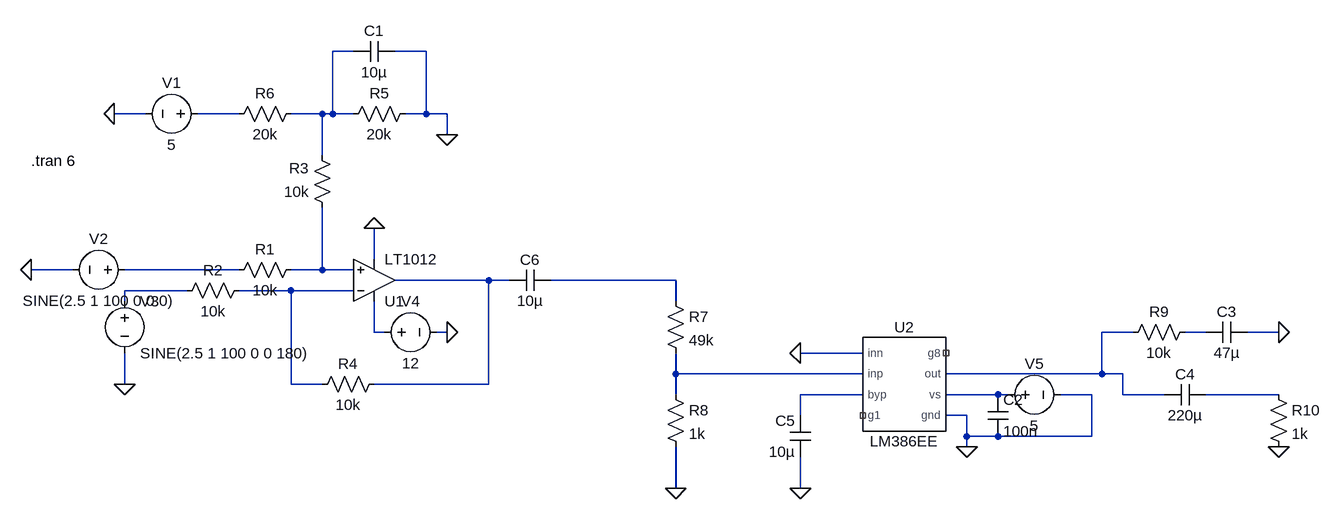
[diagram p0: schematic AudioDiffAmpSeatside_extended.asc]
AudioDiffAmpSeatside_extended.asc, the LTspice schematic file:
Version 4
SHEET 1 1908 740
WIRE 256 -48 224 -48
WIRE 368 -48 320 -48
WIRE -64 48 -112 48
WIRE 80 48 16 48
WIRE 208 48 160 48
WIRE 224 48 224 -48
WIRE 224 48 208 48
WIRE 256 48 224 48
WIRE 368 48 368 -48
WIRE 368 48 336 48
WIRE 400 48 368 48
WIRE 400 80 400 48
WIRE 208 112 208 48
WIRE 288 272 288 224
WIRE -176 288 -240 288
WIRE 80 288 -96 288
WIRE 208 288 208 192
WIRE 208 288 160 288
WIRE 256 288 208 288
WIRE 464 304 320 304
WIRE 496 304 464 304
WIRE 752 304 560 304
WIRE 0 320 -96 320
WIRE 160 320 80 320
WIRE 256 320 160 320
WIRE -96 336 -96 320
WIRE 752 336 752 304
WIRE 288 384 288 336
WIRE 304 384 288 384
WIRE 400 384 384 384
WIRE 1456 384 1408 384
WIRE 1568 384 1536 384
WIRE 1680 384 1632 384
WIRE 1040 416 944 416
WIRE 752 448 752 416
WIRE 1040 448 752 448
WIRE 1408 448 1408 384
WIRE 1408 448 1168 448
WIRE 1440 448 1408 448
WIRE -96 464 -96 416
WIRE 160 464 160 320
WIRE 208 464 160 464
WIRE 464 464 464 304
WIRE 464 464 288 464
WIRE 752 480 752 448
WIRE 1040 480 944 480
WIRE 1248 480 1168 480
WIRE 1264 480 1248 480
WIRE 1392 480 1344 480
WIRE 1440 480 1440 448
WIRE 1504 480 1440 480
WIRE 1680 480 1568 480
WIRE 944 512 944 480
WIRE 1200 512 1168 512
WIRE 1200 544 1200 512
WIRE 1248 544 1200 544
WIRE 1392 544 1392 480
WIRE 1392 544 1248 544
WIRE 1200 560 1200 544
WIRE 752 624 752 560
WIRE 944 624 944 576
FLAG 400 80 0
FLAG -96 464 0
FLAG -240 288 0
FLAG -112 48 0
FLAG 288 224 0
FLAG 400 384 0
FLAG 752 624 0
FLAG 944 416 0
FLAG 1200 560 0
FLAG 1680 384 0
FLAG 944 624 0
FLAG 1680 560 0
SYMBOL Res 176 272 R90
WINDOW 0 0 56 VBottom 2
WINDOW 3 32 56 VTop 2
SYMATTR InstName R1
SYMATTR Value 10k
SYMBOL Res 96 304 R90
WINDOW 0 0 56 VBottom 2
WINDOW 3 32 56 VTop 2
SYMATTR InstName R2
SYMATTR Value 10k
SYMBOL Res 224 208 R180
WINDOW 0 36 76 Left 2
WINDOW 3 36 40 Left 2
SYMATTR InstName R3
SYMATTR Value 10k
SYMBOL Res 192 480 R270
WINDOW 0 32 56 VTop 2
WINDOW 3 0 56 VBottom 2
SYMATTR InstName R4
SYMATTR Value 10k
SYMBOL LT1012 288 368 M180
SYMATTR InstName U1
SYMBOL Res 352 32 R90
WINDOW 0 0 56 VBottom 2
WINDOW 3 32 56 VTop 2
SYMATTR InstName R5
SYMATTR Value 20k
SYMBOL Res 176 32 R90
WINDOW 0 0 56 VBottom 2
WINDOW 3 32 56 VTop 2
SYMATTR InstName R6
SYMATTR Value 20k
SYMBOL Voltage 32 48 R90
WINDOW 0 -32 56 VBottom 2
WINDOW 3 32 56 VTop 2
WINDOW 123 0 0 Left 0
WINDOW 39 0 0 Left 0
SYMATTR InstName V1
SYMATTR Value 5
SYMBOL Voltage -80 288 R90
WINDOW 0 -32 56 VBottom 2
WINDOW 3 32 56 VTop 2
WINDOW 123 0 0 Left 0
WINDOW 39 0 0 Left 0
SYMATTR InstName V2
SYMATTR Value SINE(2.5 1 100 0 0 0)
SYMBOL Voltage -96 320 R0
SYMATTR InstName V3
SYMATTR Value SINE(2.5 1 100 0 0 180)
SYMBOL Voltage 288 384 R270
WINDOW 0 32 56 VTop 2
WINDOW 3 -32 56 VBottom 2
WINDOW 123 0 0 Left 0
WINDOW 39 0 0 Left 0
SYMATTR InstName V4
SYMATTR Value 12
SYMBOL res 736 320 R0
SYMATTR InstName R7
SYMATTR Value 49k
SYMBOL AutoGenerated\\LM386EE 1104 464 R0
SYMATTR InstName U2
SYMBOL voltage 1248 480 R270
WINDOW 0 32 56 VTop 2
WINDOW 3 -32 56 VBottom 2
WINDOW 123 0 0 Left 0
WINDOW 39 0 0 Left 0
SYMATTR InstName V5
SYMATTR Value 5
SYMBOL cap 1232 480 R0
SYMATTR InstName C2
SYMATTR Value 100n
SYMBOL res 1552 368 R90
WINDOW 0 0 56 VBottom 2
WINDOW 3 32 56 VTop 2
SYMATTR InstName R9
SYMATTR Value 10k
SYMBOL cap 1632 368 R90
WINDOW 0 0 32 VBottom 2
WINDOW 3 32 32 VTop 2
SYMATTR InstName C3
SYMATTR Value 47µ
SYMBOL cap 1568 464 R90
WINDOW 0 0 32 VBottom 2
WINDOW 3 32 32 VTop 2
SYMATTR InstName C4
SYMATTR Value 220µ
SYMBOL cap 960 576 R180
WINDOW 0 24 56 Left 2
WINDOW 3 24 8 Left 2
SYMATTR InstName C5
SYMATTR Value 10µ
SYMBOL res 736 464 R0
SYMATTR InstName R8
SYMATTR Value 1k
SYMBOL cap 560 288 R90
WINDOW 0 0 32 VBottom 2
WINDOW 3 32 32 VTop 2
SYMATTR InstName C6
SYMATTR Value 10µ
SYMBOL cap 320 -64 R90
WINDOW 0 0 32 VBottom 2
WINDOW 3 32 32 VTop 2
SYMATTR InstName C1
SYMATTR Value 10µ
SYMBOL res 1664 464 R0
SYMATTR InstName R10
SYMATTR Value 1k
TEXT -240 120 Left 2 !.tran 6

The netlist it stands for:
* AudioDiffAmpSeatside_extended.asc
R1 N004 N003 10k
R2 N008 N007 10k
R3 N004 N001 10k
R4 N008 N005 10k
* U1: LT1012 (symbol LT1012 not available, pins judged from their places): In+=N004 In-=N008 V+=N009 V-=0 OUT=N005
R5 0 N001 20k
R6 N001 N002 20k
V1 N002 0 5
V2 N003 0 SINE(2.5 1 100 0 0 0)
V3 N007 0 SINE(2.5 1 100 0 0 180)
V4 N009 0 12
R7 N006 N012 49k
XU2 0 N012 N013 NC_01 NC_02 N010 N014 0 LM386EE  ; pins inn inp byp g1 g8 out vs gnd
V5 N014 0 5
C2 N014 0 100n
R9 N011 N010 10k
C3 0 N011 47µ
C4 N015 N010 220µ
C5 0 N013 10µ
R8 N012 0 1k
C6 N006 N005 10µ
C1 0 N001 10µ
R10 N015 0 1k
.tran 6
.lib C:\Users\USER\Documents\LTspice\LM386EE.sub
.backanno
.end